# EAGLE design ESP-Platine (EAGLE 6.6.0)
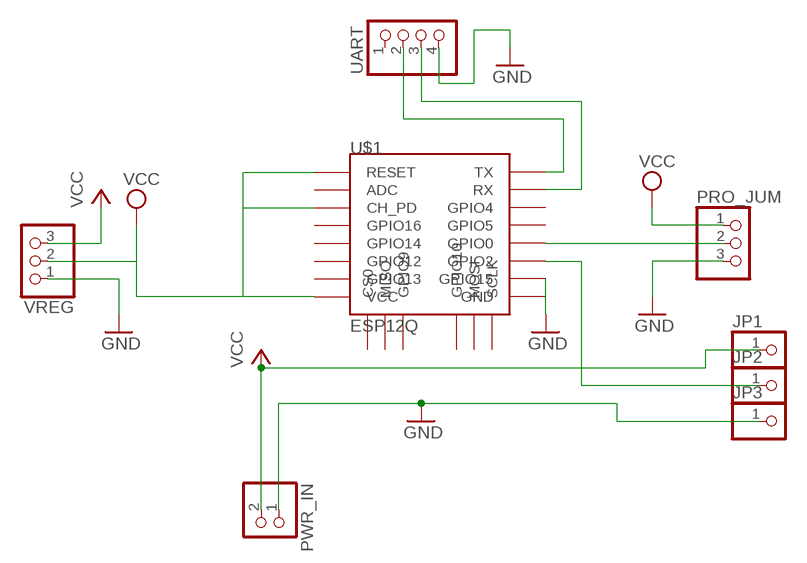
[diagram p0: schematic, sheet 1]

## Parts
JP1  PINHD-1X1  [1X01]
JP2  PINHD-1X1  [1X01]
JP3  PINHD-1X1  [1X01]
PRO_JUM  PINHD-1X3  [1X03]
PWR_IN  PINHD-1X2  [1X02]
U$1  ESP12Q  [ESP12Q]
UART  PINHD-1X4  [1X04]
VREG  PINHD-1X3  [1X03]

## Nets
3V3: PRO_JUM.1 U$1.CH_PD U$1.RESET U$1.VCC VREG.2 ; supply symbol labelled VCC
5V_IN: JP1.1 PWR_IN.2 VREG.3 ; supply symbol labelled VCC
GND: JP3.1 PRO_JUM.3 PWR_IN.1 U$1.GND U$1.GPIO15 UART.4 VREG.1
GPIO0: PRO_JUM.2 U$1.GPIO0
GPIO2: JP2.1 U$1.GPIO2
RX: U$1.RX UART.3
TX: U$1.TX UART.2
Unconnected: U$1.ADC U$1.CS0 U$1.GPIO4 U$1.GPIO5 U$1.GPIO9 U$1.GPIO10 U$1.GPIO12 U$1.GPIO13 U$1.GPIO14 U$1.GPIO16 U$1.MISO U$1.MOSI U$1.SCLK UART.1

## Library data of the parts
JP1-JP3 = pinhead:PINHD-1X1: PIN HEADER
PRO_JUM VREG = pinhead:PINHD-1X3: PIN HEADER
PWR_IN = pinhead:PINHD-1X2: PIN HEADER
U$1 = esp826612q:ESP12Q: ESP8266 Wifi module 12-Q
UART = pinhead:PINHD-1X4: PIN HEADER

## Board
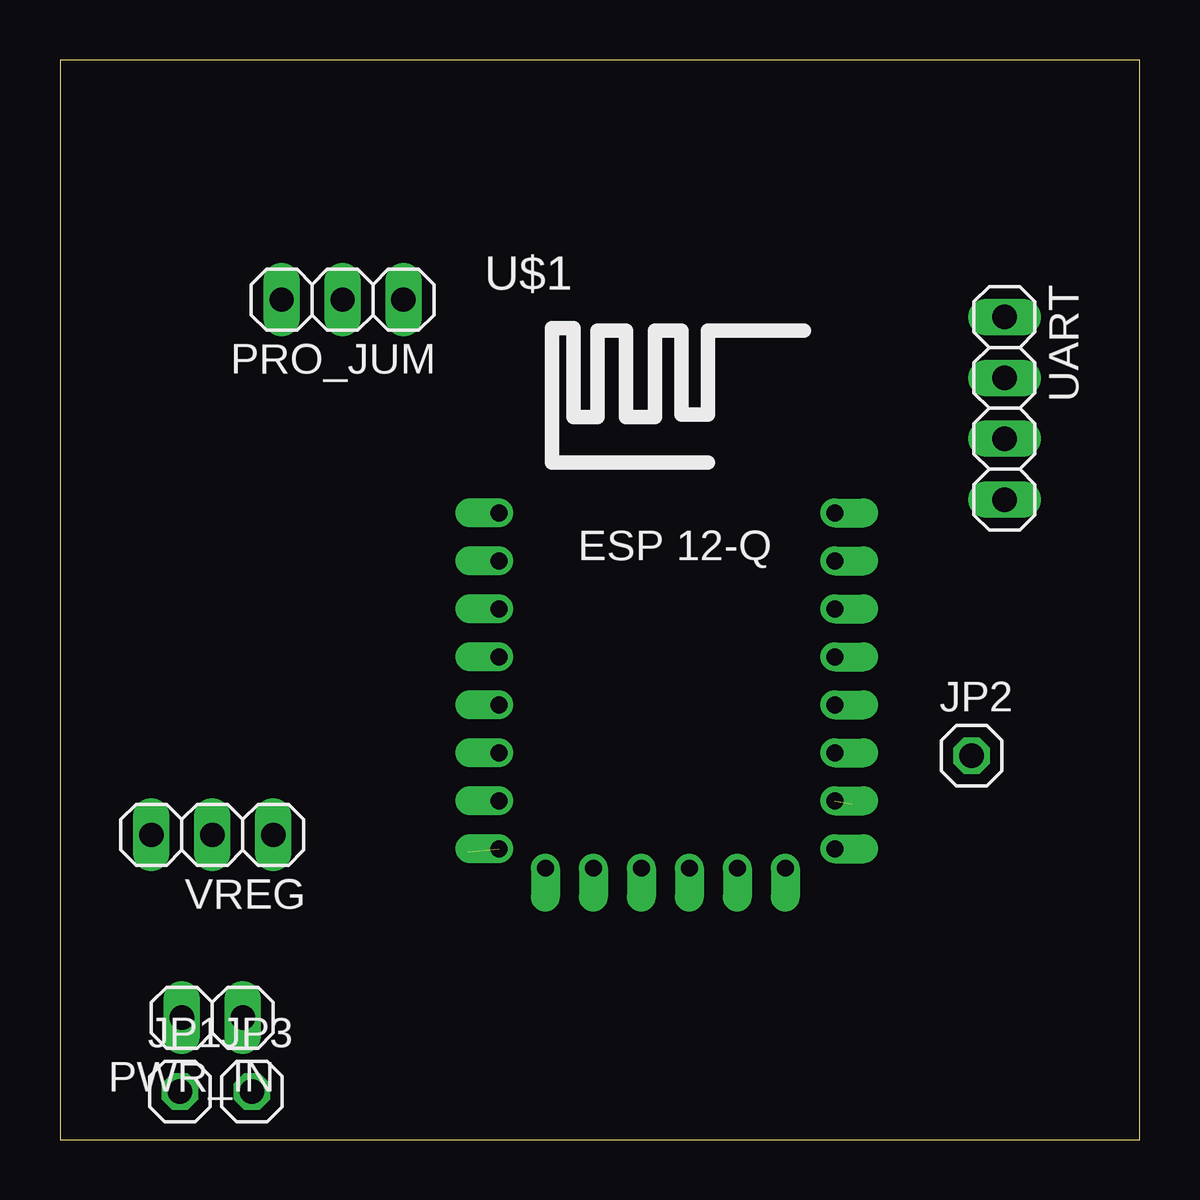
[diagram p1: board, top side]
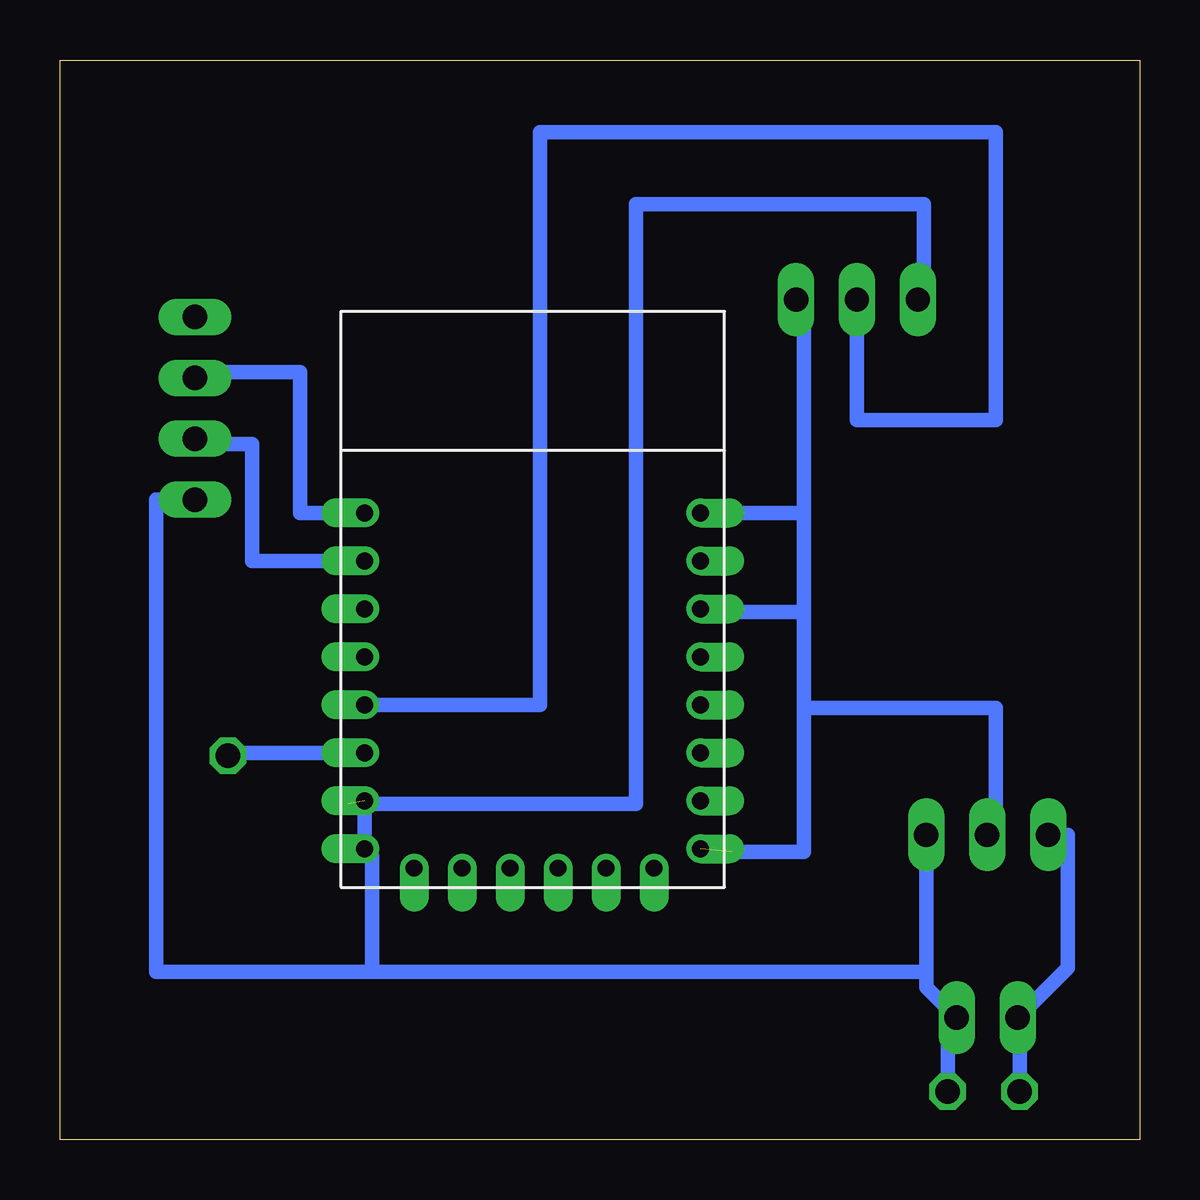
[diagram p2: board, bottom side, seen from below]

Size 45 x 45 mm. Coordinates in mm from the lower left corner, seen from the top.
Outline: 0,0 45,0 45,45 0,45 0,0
Copper layers (1*16): Top 0.035mm / dielectric 1.5mm / Bottom 0.035mm
Design rules "default": minimum track width 10mil, minimum drill 24mil, track to track 8mil, track to pad 8mil, pad to pad 8mil, via to via 8mil, smd to smd 8mil, copper to edge 40mil, drill to drill 8mil, minimum pad ring 10mil, minimum via ring 8mil, stop-mask expansion 4mil, vias tented up to drill 0mil, thermal gap 10mil

### Footprints (pad centres in the part's own frame; a part is rotated, then mirrored left to right if it is on the bottom)
1X01 = drill 1.016 octagon: 1 0,0
1X03 = drill 1.016 long: 1 -2.54,0; 2 0,0; 3 2.54,0
1X02 = drill 1.016 long: 1 -1.27,0; 2 1.27,0
ESP12Q = drill 0.7 offset: ADC -7.1,3.8; CH_PD -7.1,1.8; CS0 -5.165,-9.005; GND 6.9,-8.2; GPIO0 6.9,-2.2; GPIO2 6.9,-4.2; GPIO4 6.9,1.8; GPIO5 6.9,-0.2; GPIO9 -1.165,-9.005; GPIO10 0.835,-9.005; GPIO12 -7.1,-4.2; GPIO13 -7.1,-6.2; GPIO14 -7.1,-2.2; GPIO15 6.9,-6.2; GPIO16 -7.1,-0.2; MISO -3.165,-9.005; MOSI 2.835,-9.005; RESET -7.1,5.8; RX 6.9,3.8; SCLK 4.835,-9.005; TX 6.9,5.8; VCC -7.1,-8.2
1X04 = drill 1.016 long: 1 -3.81,0; 2 -1.27,0; 3 1.27,0; 4 3.81,0

### Placement (x,y rotation side)
JP1  5,2 0 top
JP2  38,16 0 top
JP3  8,2 0 top
PRO_JUM  11.78,35.01 180 top
PWR_IN  6.35,5.08 180 top
U$1  25.4,20.32 0 top
UART  39.37,30.48 270 top
VREG  6.35,12.7 180 top

### Tracks (layer width: path | path; a pad name or v marks a point on that pad's centre or on a via)
3V3  (1 unrouted)
  Bottom 0.406: 18.3,22 U$1.CH_PD | VREG.2 6,12.7 | PRO_JUM.1 14,34.69
  Bottom 0.61: U$1.RESET 14,26.12 | 14,26.12 14,25 14,22 | 18.3,22 14,22 | 14,22 14,18 | 14,18 14,12 17,12 | 6,12.7 6,18 14,18 | 14,34.69 14,26.12
5V_IN
  Bottom 0.406: 5,5 PWR_IN.2 5,5.08 | VREG.3 3,12.7
  Bottom 0.61: 5,5.08 JP1.1 | 3,12.7 3,7.16 PWR_IN.2
GND  (1 unrouted)
  Bottom 0.406: U$1.GND 32,11.82 | PRO_JUM.3 9,35.25 | 8,4.7 PWR_IN.1
  Bottom 0.61: PWR_IN.1 8.89,6.35 8.89,7 | 8.89,7 VREG.1 | 32,7 8.89,7 | U$1.GPIO15 U$1.GND | 32,11.82 32,7 | 9,35.25 9,39 21,39 21,14 33,14 | UART.4 41,26.67 41,7 32,7 | JP3.1 8,4.7
GPIO0
  Bottom 0.61: U$1.GPIO0 25,18.12 25,42 6,42 6,30 11.78,30 PRO_JUM.2
GPIO2
  Bottom 0.406: 38,16.12 JP2.1
  Bottom 0.61: U$1.GPIO2 38,16.12
RX
  Bottom 0.406: 39.37,29 UART.3
  Bottom 0.61: U$1.RX 37,24.12 37,29 39.37,29
TX
  Bottom 0.406: 39.37,32 UART.2
  Bottom 0.61: U$1.TX 35,26.12 35,32 39.37,32